# EAGLE design MUX_1_1 (EAGLE 8.3.2)
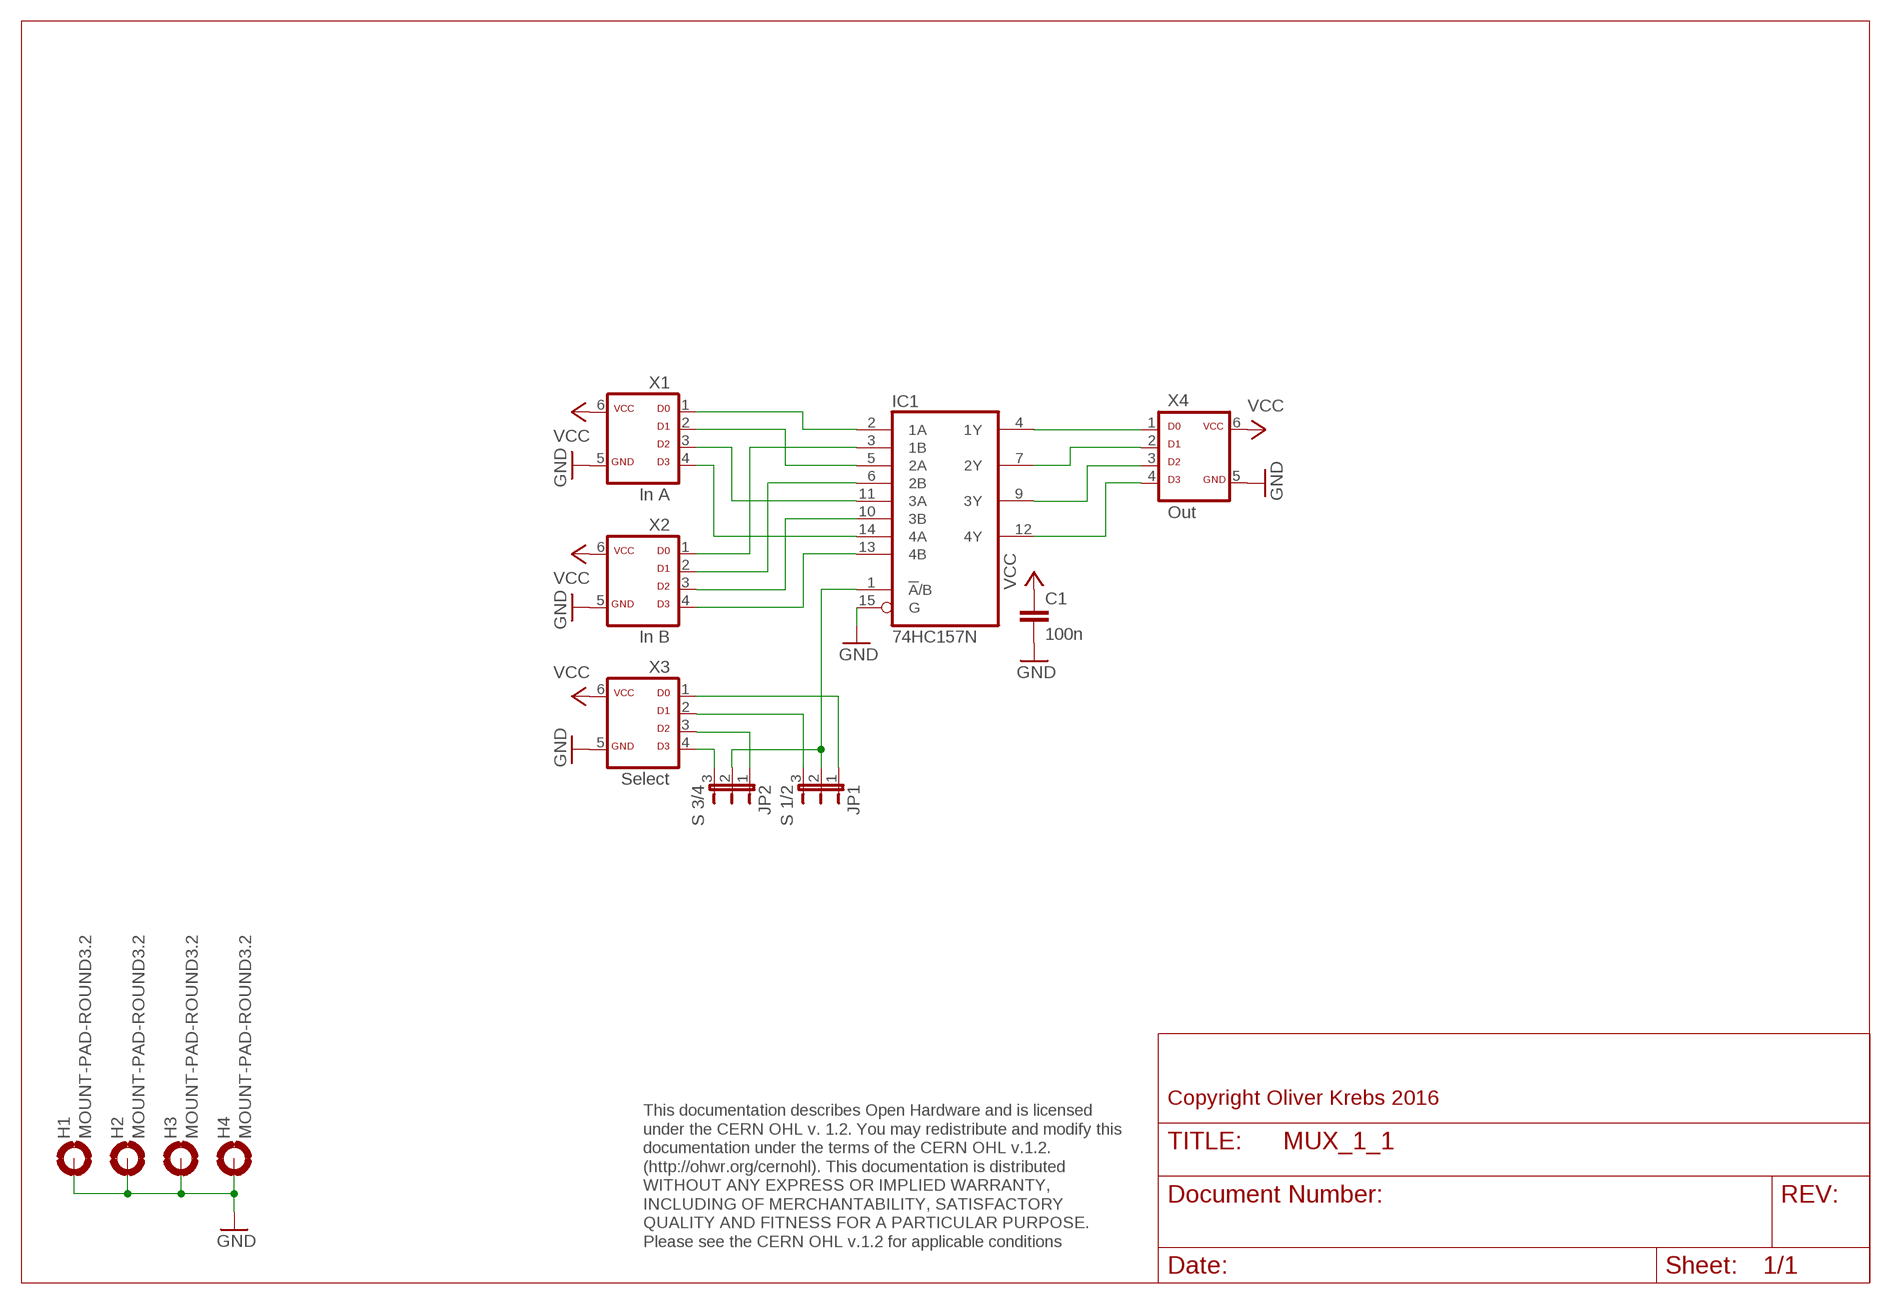
[diagram p0: schematic, sheet 1]

## Parts
C1  100n  C-EU050-025X075  [C050-025X075]
H1  MOUNT-PAD-ROUND3.2  [3,2-PAD]
H2  MOUNT-PAD-ROUND3.2  [3,2-PAD]
H3  MOUNT-PAD-ROUND3.2  [3,2-PAD]
H4  MOUNT-PAD-ROUND3.2  [3,2-PAD]
IC1  74HC157N  [DIL16]
JP1  S 1/2  JP2E  [JP2]
JP2  S 3/4  JP2E  [JP2]
X1  In A  ML6D  [ML-6]
X2  In B  ML6D  [ML-6]
X3  Select  ML6D  [ML-6]
X4  Out  ML6D  [ML-6]

## Nets
GND: C1.2 H1.B3,2(MOUNT) H2.B3,2(MOUNT) H3.B3,2(MOUNT) H4.B3,2(MOUNT) IC1.15(G) X1.5 X2.5 X3.5 X4.5
N$1: IC1.2(1A) X1.1
N$2: IC1.5(2A) X1.2
N$3: IC1.11(3A) X1.3
N$4: IC1.14(4A) X1.4
N$5: IC1.3(1B) X2.1
N$6: IC1.6(2B) X2.2
N$7: IC1.10(3B) X2.3
N$8: IC1.13(4B) X2.4
N$9: IC1.4(1Y) X4.1
N$10: IC1.7(2Y) X4.2
N$11: IC1.9(3Y) X4.3
N$12: IC1.12(4Y) X4.4
N$13: IC1.1(!A!/B) JP1.2 JP2.2
N$14: JP1.3 X3.2
N$15: JP2.1 X3.3
N$17: JP1.1 X3.1
N$19: JP2.3 X3.4
VCC: C1.1 X1.6 X2.6 X3.6 X4.6

## Notes on the sheet
- Copyright Oliver Krebs 2016
- This documentation describes Open Hardware and is licensed 
  under the CERN OHL v. 1.2. You may redistribute and modify this 
  documentation under the terms of the CERN OHL v.1.2. 
  (http://ohwr.org/cernohl). This documentation is distributed
  WITHOUT ANY EXPRESS OR IMPLIED WARRANTY, 
  INCLUDING OF MERCHANTABILITY, SATISFACTORY 
  QUALITY AND FITNESS FOR A PARTICULAR PURPOSE. 
  Please see the CERN OHL v.1.2 for applicable conditions

## Power pins joined to a net without a drawn wire
GND: IC1.8(GND)
VCC: IC1.16(VCC)

## Library data of the parts
C1 = 01-my_rcl:C-EU: CAPACITOR, European symbol
H1-H4 = holes:MOUNT-PAD-ROUND: MOUNTING PAD, round
IC1 = 74xx-eu:74*157: Quadruple 2-line to 1-line data SELECTOR/MULTIPLEXER
JP1 JP2 = jumper:JP2E: JUMPER
X1-X4 = 01-my-con:ML6D

## Board
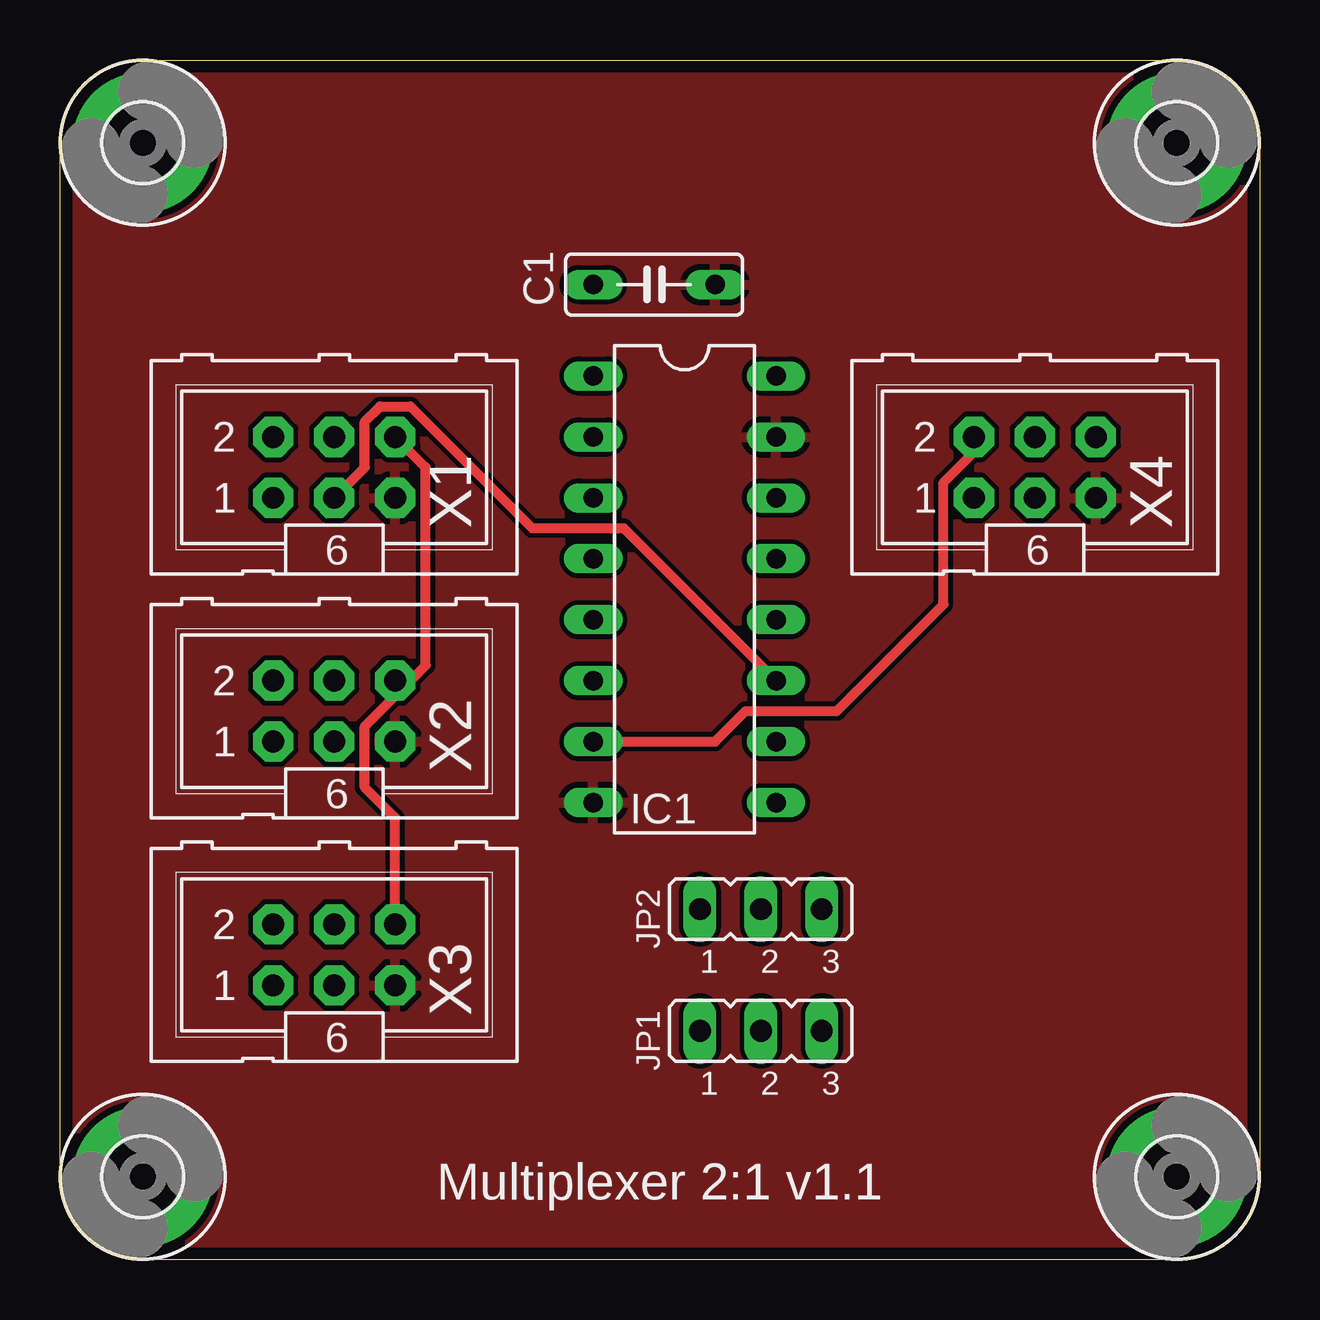
[diagram p1: board, top side]
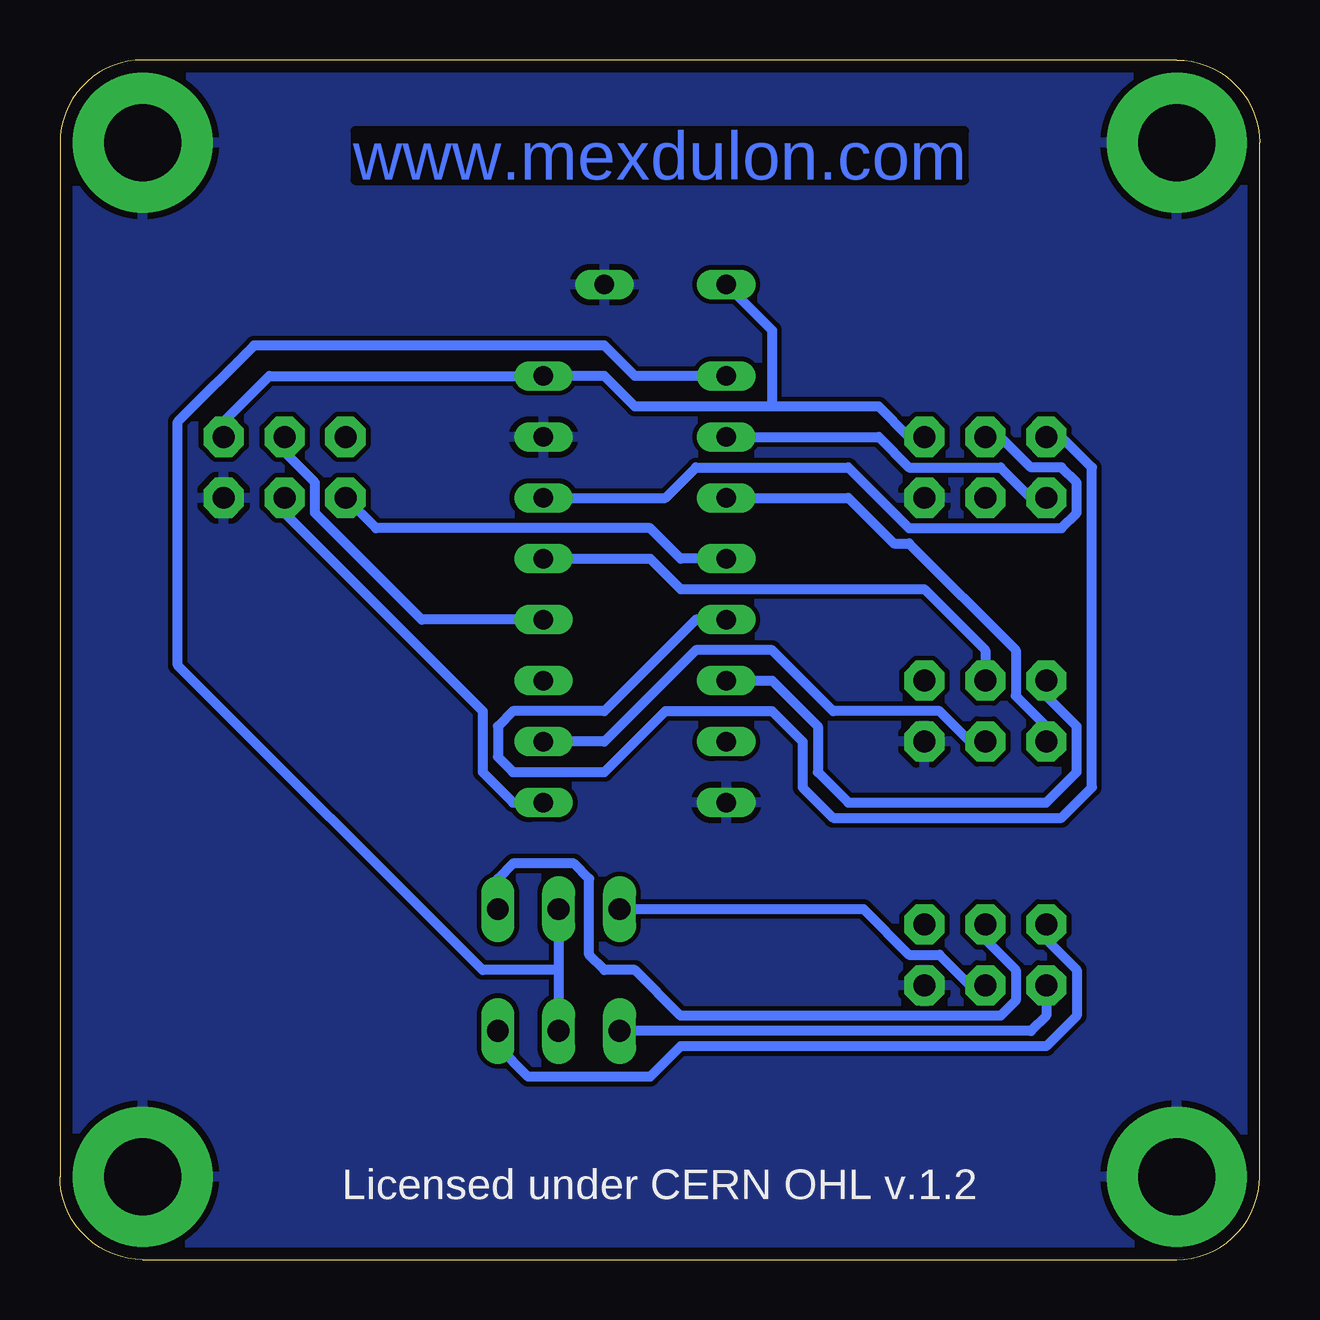
[diagram p2: board, bottom side, seen from below]

Size 50 x 50 mm. Coordinates in mm from the lower left corner, seen from the top.
Outline: 0,3.45 0,46.55 arc-90 3.45,50 46.55,50 arc-90 50,46.55 50,3.45 arc-90 46.55,0 3.45,0 arc-90 0,3.45
Copper layers (1*16): Top 0.035mm / dielectric 1.6mm / Bottom 0.035mm
Design rules "Elecrow_2-layer_PCB_eagle_rule": minimum track width 6mil, minimum drill 12mil, track to track 6mil, track to pad 6mil, pad to pad 6mil, via to via 8mil, smd to smd 0mil, copper to edge 20mil, drill to drill 10mil, minimum pad ring 6mil, minimum via ring 6mil, stop-mask expansion 0mil, vias tented up to drill 100mil, thermal gap 10mil

### Footprints (pad centres in the part's own frame; a part is rotated, then mirrored left to right if it is on the bottom)
C050-025X075 = drill 0.813 long: 1 -2.54,0; 2 2.54,0
3,2-PAD = drill 3.2 pad 5.842: B3,2 0,0
DIL16 = drill 0.813 long: 1 -8.89,-3.81; 2 -6.35,-3.81; 3 -3.81,-3.81; 4 -1.27,-3.81; 5 1.27,-3.81; 6 3.81,-3.81; 7 6.35,-3.81; 8 8.89,-3.81; 9 8.89,3.81; 10 6.35,3.81; 11 3.81,3.81; 12 1.27,3.81; 13 -1.27,3.81; 14 -3.81,3.81; 15 -6.35,3.81; 16 -8.89,3.81
JP2 = drill 0.914 long: 1 -2.54,0; 2 0,0; 3 2.54,0
ML-6 = drill 0.914 pad 1.676 octagon: 1 -2.54,-1.27; 2 -2.54,1.27; 3 0,-1.27; 4 0,1.27; 5 2.54,-1.27; 6 2.54,1.27

### Placement (x,y rotation side)
C1  24.77,40.64 0 top
H1  3.45,3.45 0 top
H2  3.45,46.55 0 top
H3  46.55,46.55 0 top
H4  46.55,3.45 0 top
IC1  26.04,27.94 270 top
JP1  29.21,9.53 0 top
JP2  29.21,14.61 0 top
X1  11.43,33.02 0 top
X2  11.43,22.86 0 top
X3  11.43,12.7 0 top
X4  40.64,33.02 0 top

### Tracks (layer width: path | path; a pad name or v marks a point on that pad's centre or on a via)
GND
  pour Top (isolate 0.203): 0,50.8 50.8,50.8 50.8,0 0,0
  pour Bottom (isolate 0.203): 0,50.8 50.8,50.8 50.8,0 0,0
N$1
  Bottom 0.406: IC1.2 15.88,34.29 14.61,33.02 10.79,33.02 9.53,31.75 X1.1
N$2
  Bottom 0.406: IC1.5 23.5,26.67 27.3,22.86 31.11,22.86 31.75,22.23 31.75,20.95 31.11,20.32 27.3,20.32 24.77,22.86 20.32,22.86 19.05,21.59 19.05,19.68 17.78,18.41 8.26,18.41 6.99,19.68 6.99,33.02 8.26,34.29 X1.2
N$3
  Top 0.406: X1.3 12.7,33.02 12.7,34.92 13.34,35.56 14.61,35.56 19.68,30.48 23.5,30.48 IC1.11
N$4
  Bottom 0.406: IC1.14 24.77,31.75 23.5,33.02 17.14,33.02 14.61,30.48 8.26,30.48 7.62,31.11 7.62,32.38 8.26,33.02 9.53,33.02 10.79,34.29 X1.4
N$5
  Bottom 0.406: IC1.3 17.14,31.75 15.24,29.84 14.61,29.84 10.16,25.4 10.16,23.5 8.89,22.23 X2.1
N$6
  Bottom 0.406: IC1.6 20.32,24.13 18.41,22.23 18.41,20.32 17.14,19.05 8.89,19.05 7.62,20.32 7.62,22.23 8.89,23.5 X2.2
N$7
  Bottom 0.406: X2.3 12.06,21.59 13.34,22.86 17.78,22.86 20.32,25.4 23.5,25.4 27.3,21.59 IC1.10
N$8
  Bottom 0.406: IC1.13 25.4,29.21 24.13,27.94 13.97,27.94 11.43,25.4 X2.4
N$9
  Bottom 0.406: IC1.4 24.13,29.21 25.4,30.48 36.83,30.48 X4.1
N$10
  Top 0.406: IC1.7 27.3,21.59 28.57,22.86 32.38,22.86 36.83,27.3 36.83,32.38 38.1,33.66 X4.2
N$11
  Bottom 0.406: X4.3 40.64,31.11 32.38,22.86 32.38,20.32 31.11,19.05 IC1.9
N$12
  Bottom 0.406: IC1.12 34.92,26.67 39.37,31.11 39.37,32.38 40.64,33.66 X4.4
N$13
  Bottom 0.406: 29.21,12.06 JP1.2 | IC1.1 26.04,36.83 27.3,38.1 41.91,38.1 45.09,34.92 45.09,24.77 32.38,12.06 29.21,12.06 | JP2.2 29.21,12.06
N$14
  Bottom 0.406: X3.2 8.89,13.34 7.62,12.06 7.62,10.16 8.89,8.89 24.13,8.89 25.4,7.62 30.48,7.62 31.75,8.89 JP1.3
N$15
  Bottom 0.406: JP2.1 16.51,14.61 14.61,12.7 13.34,12.7 12.06,11.43 X3.3
N$17
  Bottom 0.406: X3.1 8.89,10.16 9.53,9.53 JP1.1
N$19
  Bottom 0.406: X3.4 11.43,13.34 10.16,12.06 10.16,10.79 10.79,10.16 24.13,10.16 26.04,12.06 27.3,12.06 27.94,12.7 27.94,15.88 28.57,16.51 31.11,16.51 31.75,15.88 JP2.3
VCC
  Top 0.406: X1.6 15.24,33.02 15.24,24.77 13.97,23.5 | X3.6 13.97,18.41 12.7,19.68 12.7,22.23 13.97,23.5 | 13.97,23.5 X2.6
  Bottom 0.406: X1.6 14.61,34.29 15.88,35.56 20.32,35.56 | 20.32,35.56 26.04,35.56 27.3,36.83 IC1.16 41.27,36.83 43.18,34.92 X4.6 | C1.1 20.32,38.73 20.32,35.56

### Text on the board
Bottom: www.mexdulon.com
tNames: Multiplexer 2:1 v1.1
bNames: Licensed under CERN OHL v.1.2